# EAGLE design MODUL_ADC_V101 (EAGLE 6.4)
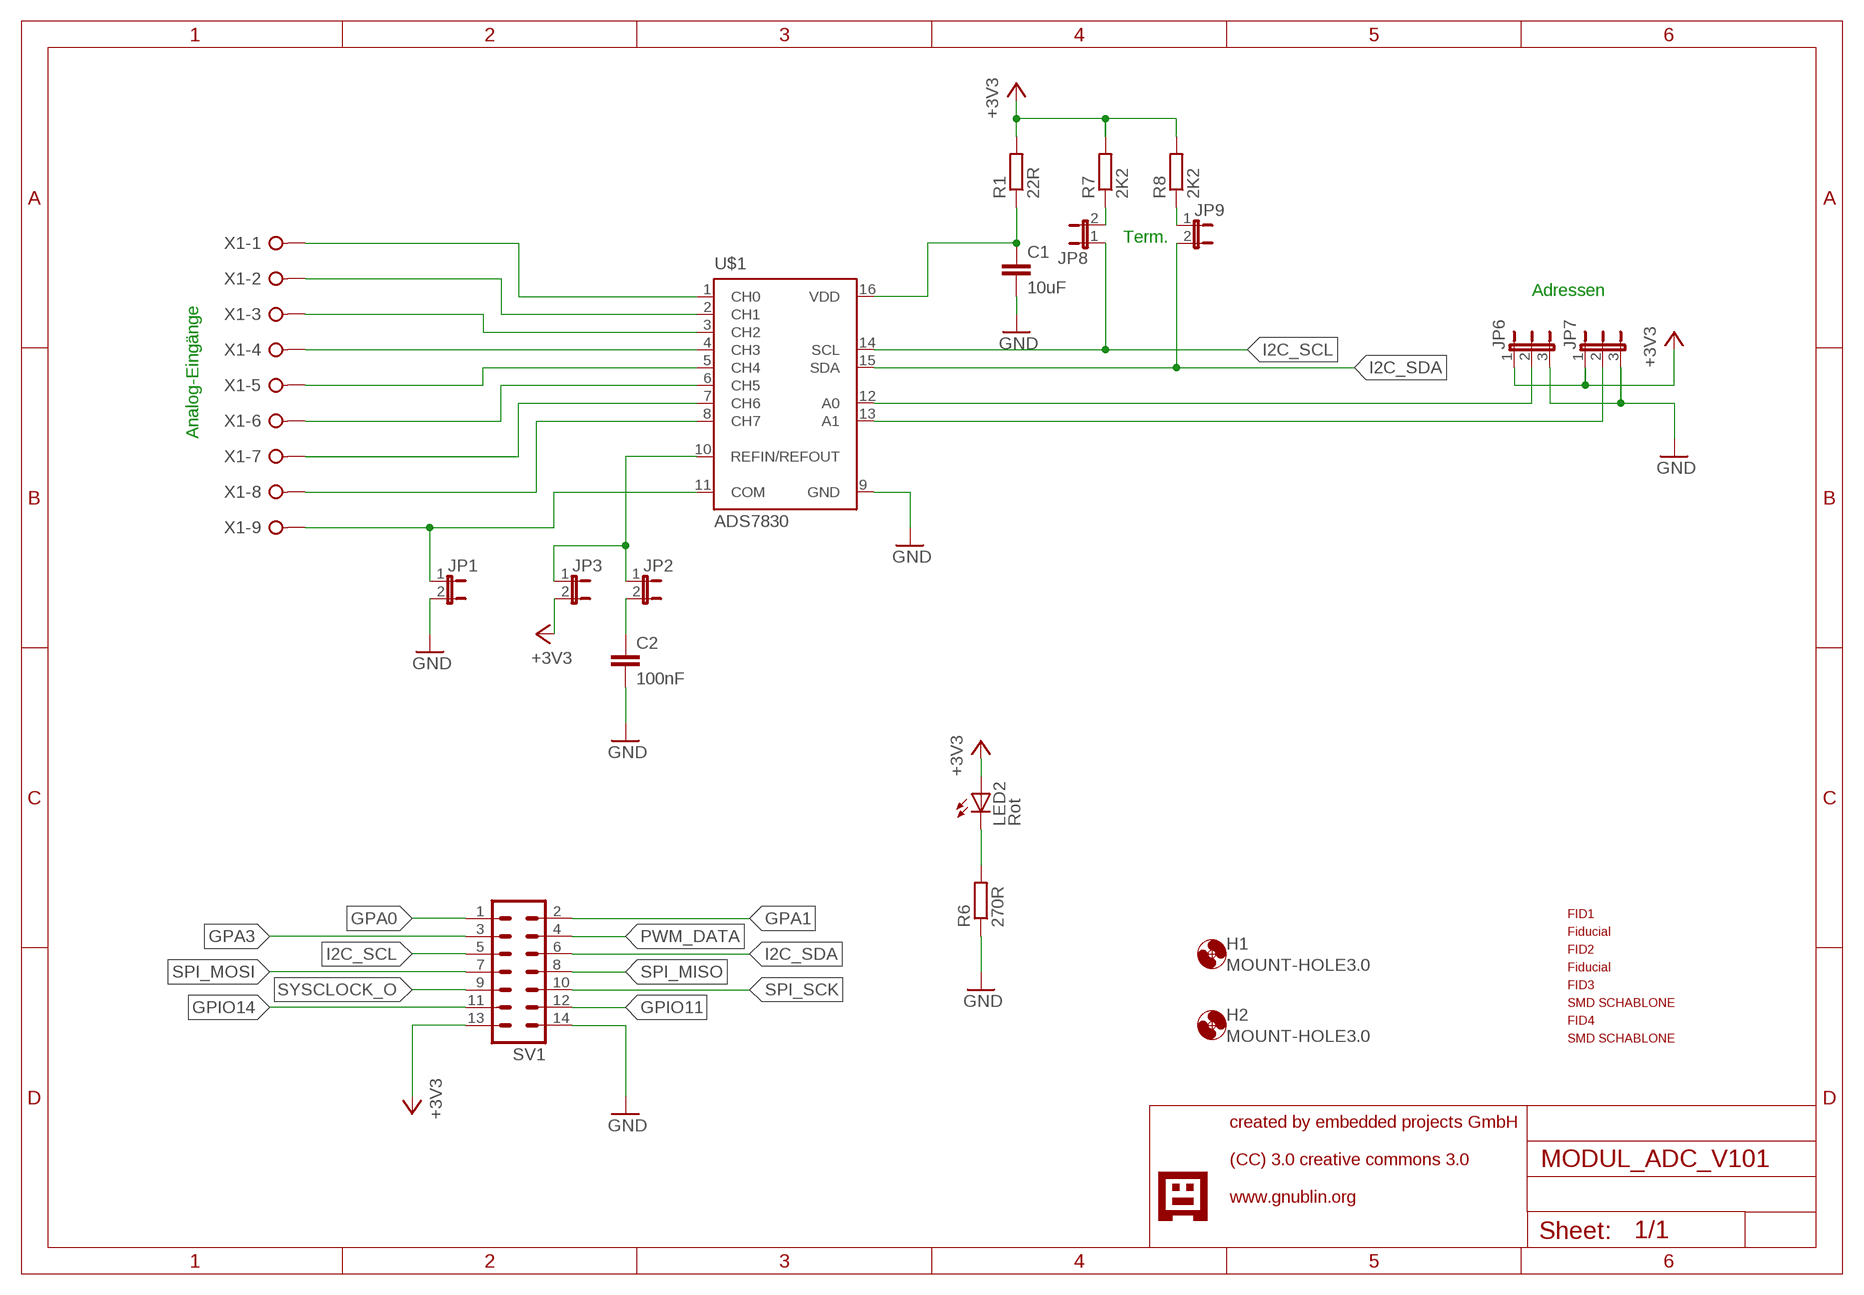
[diagram p0: schematic, sheet 1]

## Parts
C1  10uF  C-EUC0805  [C0805]
C2  100nF  C-EUC0805  [C0805]
FID1  PASSERMARKEN_FIDUCIAL  [PASSERMARKEN_FIDUCIAL]
FID2  PASSERMARKEN_FIDUCIAL  [PASSERMARKEN_FIDUCIAL]
FID3  PASSERMARKEN_FIDUCIAL  [PASSERMARKEN_FIDUCIAL]
FID4  PASSERMARKEN_FIDUCIAL  [PASSERMARKEN_FIDUCIAL]
H1  MOUNT-HOLE3.0  [3,0]
H2  MOUNT-HOLE3.0  [3,0]
JP1  JP1E  [JP1]
JP2  JP1E  [JP1]
JP3  JP1E  [JP1]
JP6  JP2E  [JP2]
JP7  JP2E  [JP2]
JP8  JP1E  [JP1]
JP9  JP1E  [JP1]
LED2  Rot  LEDCHIP-LED0805  [CHIP-LED0805]
R1  22R  R-EU_R0805  [R0805]
R6  270R  R-EU_R0805  [R0805]
R7  2K2  R-EU_R0805  [R0805]
R8  2K2  R-EU_R0805  [R0805]
SV1  ML14  [ML14]
U$1  ADS7830  [TSSOP16]
U$2  GNUBLINLOGOSIEB  [GNUSIEBDRUCK]
X1  W237-09P  [W237-9P]

## Nets
+3V3: JP3.2 JP6.1 JP7.1 LED2.A R1.2 R7.2 R8.2 SV1.13
A0: JP6.2 U$1.12(A0)
A1: JP7.2 U$1.13(A1)
GND: C1.2 C2.2 JP1.2 JP6.3 JP7.3 R6.1 SV1.14 U$1.9(GND)
GPA0: SV1.1
GPA1: SV1.2
GPA3: SV1.3
GPIO11: SV1.12
GPIO14: SV1.11
I2C_SCL: JP8.1 SV1.5 U$1.14(SCL)
I2C_SDA: JP9.2 SV1.6 U$1.15(SDA)
N$1: C1.1 R1.1 U$1.16(VDD)
N$2: JP2.1 JP3.1 U$1.10(REFIN/REFOUT)
N$3: U$1.1(CH0) X1.1
N$4: U$1.2(CH1) X1.2
N$5: U$1.3(CH2) X1.3
N$6: U$1.4(CH3) X1.4
N$7: U$1.5(CH4) X1.5
N$8: U$1.6(CH5) X1.6
N$9: LED2.C R6.2
N$10: U$1.7(CH6) X1.7
N$11: U$1.8(CH7) X1.8
N$12: JP1.1 U$1.11(COM) X1.9
N$13: C2.1 JP2.2
N$46: JP8.2 R7.1
N$47: JP9.1 R8.1
PWM_DATA: SV1.4
SPI_MISO: SV1.8
SPI_MOSI: SV1.7
SPI_SCK: SV1.10
SYSCLOCK_O: SV1.9

## Notes on the sheet
- Term.
- Adressen
- Analog-Eingänge
- created by embedded projects GmbH
  
  (CC) 3.0 creative commons 3.0
  
  www.gnublin.org

## Library data of the parts
C1 C2 = rcl:C-EU: CAPACITOR, European symbol
FID1 FID2 = KUBUS3:PASSERMARKEN_FIDUCIAL: SMD Passermarke
FID3 FID4 = SMDSCHABLONE:PASSERMARKEN_FIDUCIAL: SMD Passermarke
H1 H2 = holes:MOUNT-HOLE: MOUNTING HOLE with drill center marker
JP1-JP3 JP8 JP9 = jumper:JP1E: JUMPER
JP6 JP7 = jumper:JP2E: JUMPER
LED2 = led:LED: LED OSRAM: - CHIPLED LG R971, LG N971, LY N971, LG Q971, LY Q971, LO R971, LY R971 LH N974, LH R974 LS Q976, LO Q976, LY Q976 LO Q996 - Hyper CHIPLED LW Q18S LB Q993, LB Q99A, LB R99A - SideLED LS A670, LO A670, LY A670, LG A670, LP A670 LB A673, LV A673, LT A673, LW A673 LH A674 LY A675 LS A676, LA A676, LO A676, LY A676, LW A676 LS A679, LY A679, LG A679 - Hyper Micro SIDELED® LS Y876, LA Y876, LO Y876, LY Y876 LT Y87S - SmartLED LW L88C, LW L88S LB L89C, LB L89S, LG L890 LS L89K, LO L89K, LY L89K LS L896, LA L896, LO L896, LY L896 - TOPLED LS T670, LO T670, LY T670, LG T670, LP T670 LSG T670, LSP T670, LSY T670, LOP T670, LYG T670 LG T671, LOG T671, LSG T671 LB T673, LV T673, LT T673, LW T673 LH T674 LS T676, LA T676, LO T676, LY T676, LB T676, LH T676, LSB T676, LW T676 LB T67C, LV T67C, LT T67C, LS T67K, LO T67K, LY T67K, LW E67C LS E67B, LA E67B, LO E67B, LY E67B, LB E67C, LV E67C, LT E67C LW T67C LS T679, LY T679, LG T679 LS T770, LO T770, LY T770, LG T770, LP T770 LB T773, LV T773, LT T773, LW T773 LH T774 LS E675, LA E675, LY E675, LS T675 LS T776, LA T776, LO T776, LY T776, LB T776 LHGB T686 LT T68C, LB T68C - Hyper Mini TOPLED® LB M676 - Mini TOPLED Santana® LG M470 LS M47K, LO M47K, LY M47K Source: http://www.osram.convergy.de LUXEON: - LUMILED® LXK2-PW12-R00, LXK2-PW12-S00, LXK2-PW14-U00, LXK2-PW14-V00 LXK2-PM12-R00, LXK2-PM12-S00, LXK2-PM14-U00 LXK2-PE12-Q00, LXK2-PE12-R00, LXK2-PE12-S00, LXK2-PE14-T00, LXK2-PE14-U00 LXK2-PB12-K00, LXK2-PB12-L00, LXK2-PB12-M00, LXK2-PB14-N00, LXK2-PB14-P00, LXK2-PB14-Q00 LXK2-PR12-L00, LXK2-PR12-M00, LXK2-PR14-Q00, LXK2-PR14-R00 LXK2-PD12-Q00, LXK2-PD12-R00, LXK2-PD12-S00 LXK2-PH12-R00, LXK2-PH12-S00 LXK2-PL12-P00, LXK2-PL12-Q00, LXK2-PL12-R00 Source: www.luxeon.com KINGBRIGHT: KA-3528ASYC Source: www.kingbright.com
R1 R6-R8 = rcl:R-EU_: RESISTOR, European symbol
SV1 = con-ml:ML14: HARTING; OC_FARNELL: unknown; OC_NEWARK: unknown
U$1 = ADS7830:ADS7830; FARNELL: 1180129
U$2 = EmbeddedProjectsLogos2:GNUBLINLOGO
X1 = con-wago-508:W237-09P: WAGO SREW CLAMP; OC_FARNELL: unknown; OC_NEWARK: unknown

## Board
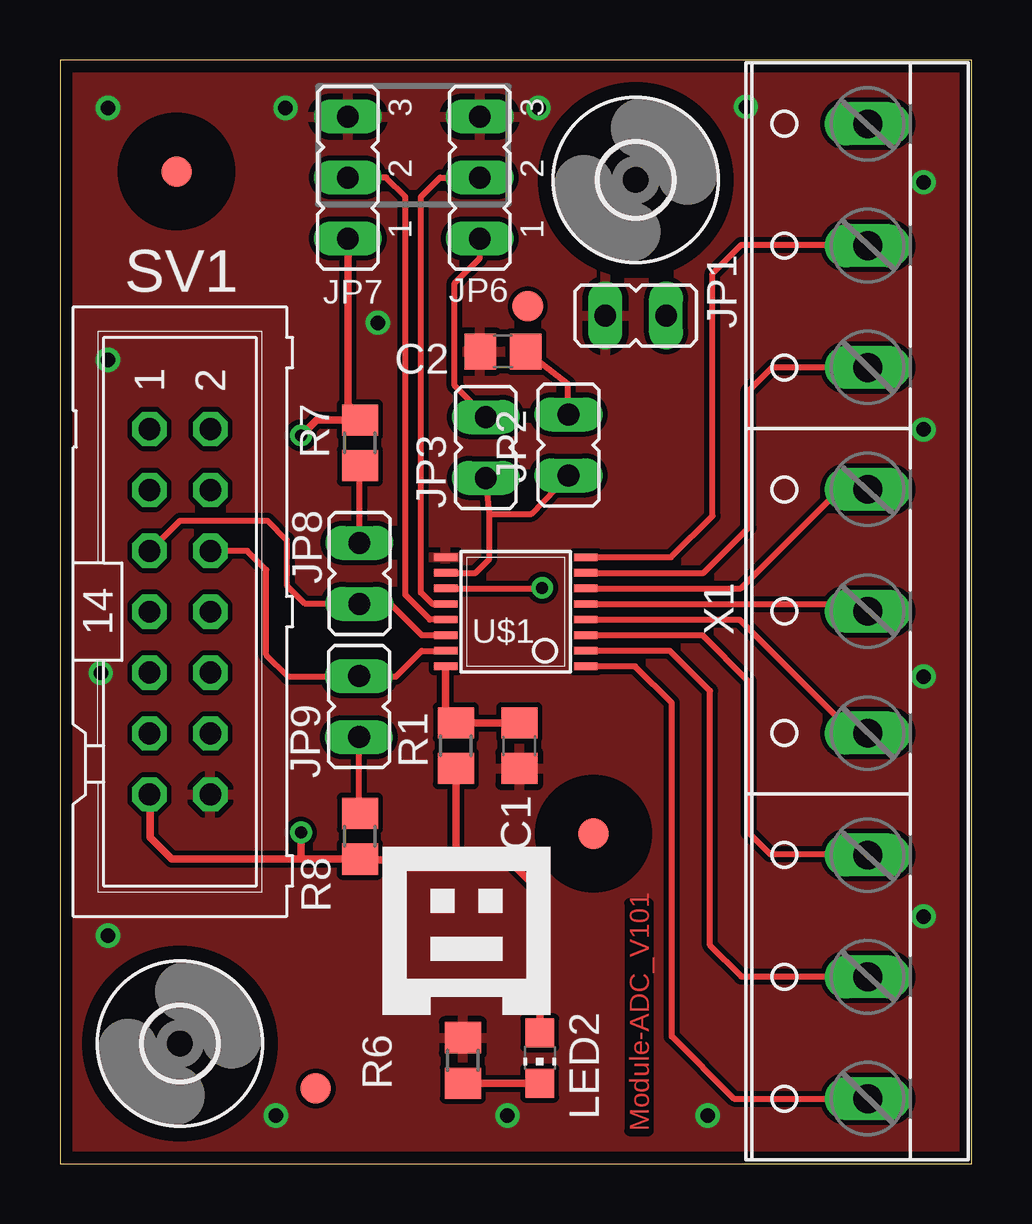
[diagram p1: board, top side]
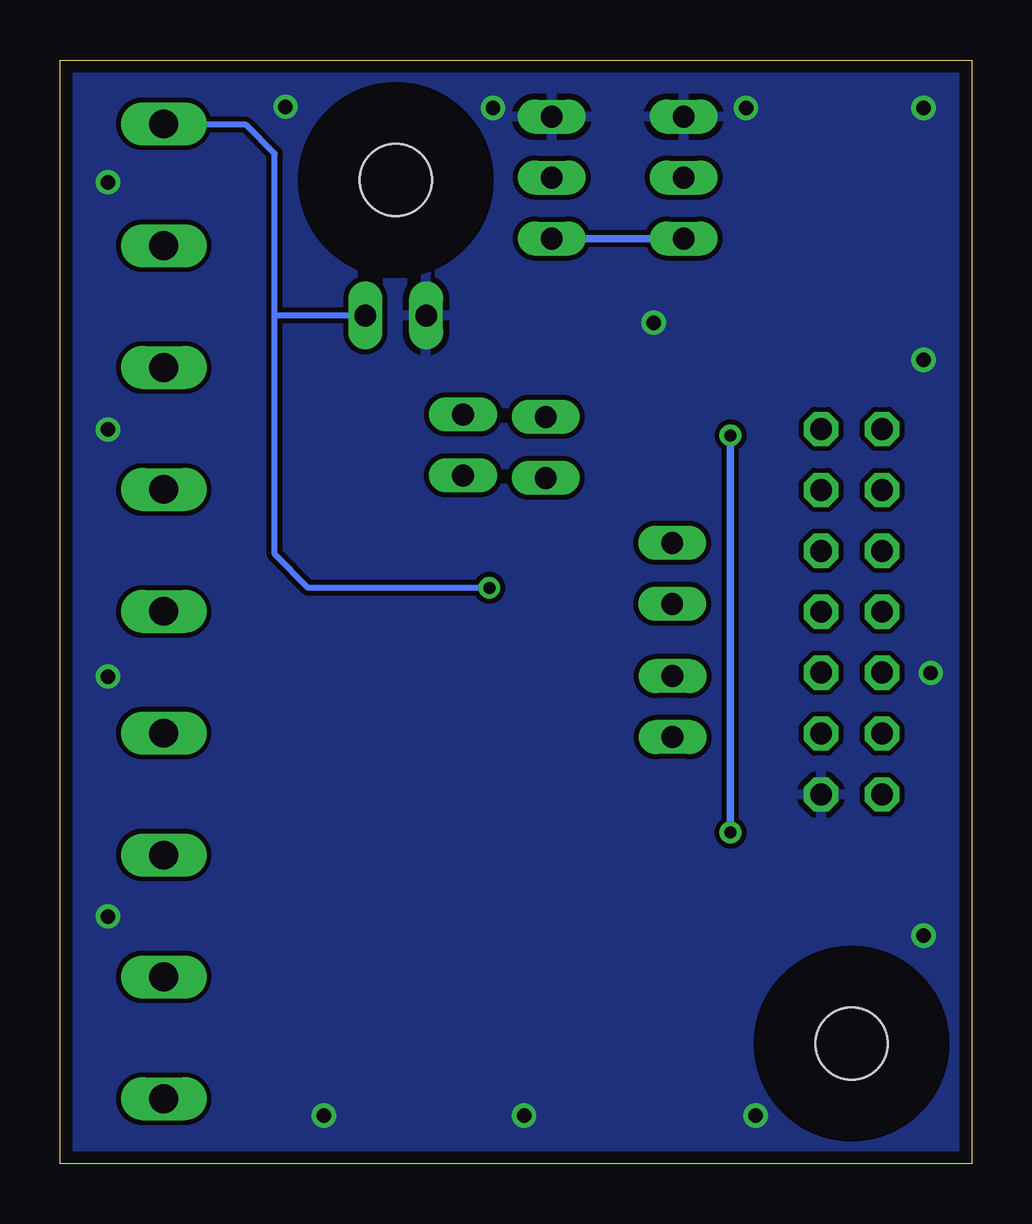
[diagram p2: board, bottom side, seen from below]

Size 38 x 46 mm. Coordinates in mm from the lower left corner, seen from the top.
Outline: 0,0 38,0 38,46 0,46 0,0
Copper layers (1*16): Top 0.035mm / dielectric 1.5mm / Bottom 0.035mm
Design rules "default *": minimum track width 10mil, minimum drill 24mil, track to track 8mil, track to pad 8mil, pad to pad 8mil, via to via 8mil, smd to smd 8mil, copper to edge 20mil, drill to drill 8mil, minimum pad ring 10mil, minimum via ring 8mil, stop-mask expansion 2mil, vias tented up to drill 40mil, thermal gap 10mil

### Footprints (pad centres in the part's own frame; a part is rotated, then mirrored left to right if it is on the bottom)
C0805 = smd 1.3 x 1.5: 1 -0.95,0; 2 0.95,0
PASSERMARKEN_FIDUCIAL = smd 1.27 x 1.27: 1 0,0
3,0 = hole 3: 0,0
JP1 = drill 0.914 long: 1 0,-1.27; 2 0,1.27
JP2 = drill 0.914 long: 1 -2.54,0; 2 0,0; 3 2.54,0
CHIP-LED0805 = smd 1.2 x 1.2: A 0,-1.05; C 0,1.05
R0805 = smd 1.3 x 1.5: 1 -0.95,0; 2 0.95,0
ML14 = drill 0.914 octagon: 1 -7.62,-1.27; 2 -7.62,1.27; 3 -5.08,-1.27; 4 -5.08,1.27; 5 -2.54,-1.27; 6 -2.54,1.27; 7 0,-1.27; 8 0,1.27; 9 2.54,-1.27; 10 2.54,1.27; 11 5.08,-1.27; 12 5.08,1.27; 13 7.62,-1.27; 14 7.62,1.27
TSSOP16 = smd 0.305 x 0.991: 1 -2.275,-2.918; 2 -1.625,-2.918; 3 -0.975,-2.918; 4 -0.325,-2.918; 5 0.325,-2.918; 6 0.975,-2.918; 7 1.625,-2.918; 8 2.275,-2.918; 9 2.275,2.918; 10 1.625,2.918; 11 0.975,2.918; 12 0.325,2.918; 13 -0.325,2.918; 14 -0.975,2.918; 15 -1.625,2.918; 16 -2.275,2.918
W237-9P = drill 1.194 long: 1 -20.32,-0.635; 2 -15.24,-0.635; 3 -10.16,-0.635; 4 -5.08,-0.635; 5 0,-0.635; 6 5.08,-0.635; 7 10.16,-0.635; 8 15.24,-0.635; 9 20.32,-0.635

### Placement (x,y rotation side)
C1  19.15,17.42 270 top
C2  18.47,33.85 180 top
FID1  22.24,13.75 0 top
FID2  4.86,41.35 0 top
FID3  19.5,35.73 0 top
FID4  10.66,3.13 0 top
H1  24,41 0 top
H2  5,5 0 top
JP1  24,35.35 90 top
JP2  21.2,29.95 0 top
JP3  17.75,29.85 0 top
JP6  17.5,41.1 90 top
JP7  12,41.1 90 top
JP8  12.48,24.6 0 top
JP9  12.46,19.05 0 top
LED2  20,4.4 180 top
R1  16.5,17.42 270 top
R6  16.8,4.3 270 top
R7  12.5,30.04 90 top
R8  12.5,13.64 270 top
SV1  5,23 270 top
U$1  19,23 90 top
U$2  13.45,6.2 0 top
X1  33.04,23.02 90 top

### Tracks (layer width: path | path; a pad name or v marks a point on that pad's centre or on a via)
+3V3  (via drill 0.5)
  Top 0.254: JP3.2 16.45,32.42 16.45,36.7 17.5,37.75 JP6.1
  Top 0.305: LED2.A 20,11.35 18.7,12.65 16.5,12.65 | 16.5,12.65 12.54,12.65 R8.2 10.05,12.69 | 16.5,12.65 R1.2 | 10.05,12.69 4.66,12.69 3.75,13.6 3.75,15.36 SV1.13 | JP7.1 12,31.64 R7.2 10.69,30.99 v10.05,30.35 | 10.05,12.69 v10.05,13.8
  Bottom 0.305: JP7.1 JP6.1 | v10.05,13.8 v10.05,30.35
A0
  Top 0.254: U$1.12 15.53,23.32 15.05,23.8 15.05,40.3 15.85,41.1 JP6.2
A1
  Top 0.254: U$1.13 15.43,22.68 14.4,23.7 14.4,40.3 13.6,41.1 JP7.2
GND  (via drill 0.6)
  other vias: 2,9.5 9,2 18.65,2 27,2 1.7,20.45 2,33.5 2,44 9.4,44 19.95,44 28.6,44.05 36,10.3 36,20.3 36,30.6 36,40.9 13.25,35.05
  pour Bottom: -1.5,47.3 39.9,47.3 39.9,-1.8 -1.5,-1.8
  pour Top: -1.3,47 39.4,47 39.4,-1.4 -1.3,-1.4
I2C_SCL
  Top 0.254: U$1.14 15.07,22.02 13.75,23.35 12.5,23.35 JP8.1 12.45,23.35 10.2,23.35 9.45,24.1 9.45,26 8.65,26.8 5,26.8 SV1.5
I2C_SDA
  Top 0.254: SV1.6 7.81,25.54 8.6,24.75 8.6,21.2 9.5,20.3 12.44,20.3 JP9.2 12.48,20.3 14,20.3 15.07,21.38 U$1.15
N$1
  Top 0.305: C1.1 R1.1 16.08,18.79 U$1.16
N$2
  Top 0.254: U$1.10 17.32,24.62 17.9,25.2 17.9,27.08 | 17.9,27.08 JP3.1 | 17.9,27.08 19.65,27.08 JP2.1
N$3
  Top 0.254: U$1.1 23.98,20.73 25.5,19.2 25.5,5.3 28.1,2.7 X1.1
N$4
  Top 0.254: U$1.2 25.43,21.38 27.1,19.7 27.1,9.1 28.4,7.8 33.66,7.8 X1.2
N$5
  Top 0.254: U$1.3 26.77,22.02 28.7,20.1 28.7,13.8 29.6,12.9 33.63,12.9 X1.3
N$6
  Top 0.254: U$1.4 28.32,22.68 33.1,17.9 33.63,17.9 X1.4
N$7
  Top 0.254: U$1.5 33.37,23.32 X1.5
N$8
  Top 0.254: U$1.6 28.38,23.98 32.5,28.1 X1.6
N$9
  Top 0.305: R6.2 LED2.C
N$10
  Top 0.254: U$1.7 26.82,24.62 28.7,26.5 28.7,32.2 29.7,33.2 33.66,33.2 X1.7
N$11
  Top 0.254: U$1.8 25.48,25.27 27.2,27 27.2,37.1 28.4,38.3 33.63,38.3 X1.8
N$12  (via drill 0.5)
  Top 0.254: U$1.11 20.07,23.98 v20.1,24
  Bottom 0.254: v20.1,24 27.65,24 29.05,25.4 29.05,35.35 | 29.05,35.35 29.05,42.1 30.25,43.3 33.63,43.3 X1.9 | JP1.1 29.05,35.35
N$13
  Top 0.254: JP2.2 21.17,32.49 C2.1
N$46
  Top 0.254: JP8.2 12.48,29.07 R7.1
N$47
  Top 0.254: JP9.1 12.46,14.63 R8.1

### Text on the board
Top: Module-ADC_V101
tDocu: GND | 8 | Adr. | GND | REF_3.3V | 7 | REF_IN / 2.5V | 6 | I2C-Pullup | 5 | 4 | 3 | 2 | Power | 1 | www.gnublin.org
bDocu: COM | CH7 | CH6 | GPA0 | GPA1 | CH5 | GPA3 | PWM | SCL | SDA | CH4 | MOSI | MISO | SCLK | SCK | CH3 | IO14 | IO11 | CH2 | +3V3 | GND | CH1 | CH0